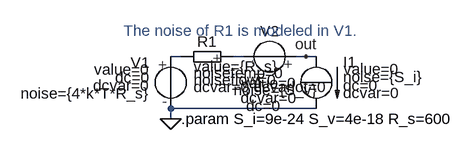
[diagram p0: schematic ExNoiseFigureAmp.asc]
ExNoiseFigureAmp.asc, the LTspice schematic file:
Version 4
SHEET 1 880 680
WIRE 128 0 112 0
WIRE 224 0 208 0
WIRE 320 0 304 0
WIRE 336 0 320 0
WIRE 336 80 112 80
WIRE 112 96 112 80
FLAG 112 96 0
FLAG 320 0 out
SYMBOL SLV 112 0 M0
WINDOW 40 32 57 Left 2
WINDOW 3 32 20 Left 2
WINDOW 123 32 32 Left 2
WINDOW 39 32 44 Left 2
SYMATTR InstName V1
SYMATTR SpiceLine2 noise={4*k*T*R_s}
SYMBOL SLR 208 0 R90
WINDOW 0 -8 40 VBottom 2
WINDOW 3 15 61 VLeft 2
WINDOW 123 25 61 VLeft 2
WINDOW 39 36 61 VLeft 2
WINDOW 40 47 61 VLeft 2
SYMATTR InstName R1
SYMATTR Value value={R_s}
SYMBOL SLI 336 0 R0
WINDOW 40 41 31 Left 2
WINDOW 3 42 19 Left 2
WINDOW 123 41 44 Left 2
WINDOW 39 41 56 Left 2
SYMATTR InstName I1
SYMATTR SpiceLine2 noise={S_i}
SYMBOL SLV 304 0 R90
WINDOW 0 -24 40 VBottom 2
WINDOW 3 25 41 VTop 2
WINDOW 123 60 49 VTop 2
WINDOW 39 48 41 VTop 2
WINDOW 40 36 30 VTop 2
SYMATTR InstName V2
SYMATTR SpiceLine2 noise={S_v}
TEXT 128 96 Left 2 !.param S_i=9e-24 S_v=4e-18 R_s=600
TEXT 40 -40 Left 2 ;The noise of R1 is modeled in V1.

The netlist it stands for:
* ExNoiseFigureAmp.asc
V1 N001 0 V value=0 dc=0 dcvar=0 noise={4*k*T*R_s}
R1 N002 N001 R value={R_s} noisetemp=0 noiseflow=0 dcvar=0 dcvarlot=0
I1 out 0 I value=0 dc=0 dcvar=0 noise={S_i}
V2 out N002 V value=0 dc=0 dcvar=0 noise={S_v}
.param S_i=9e-24 S_v=4e-18 R_s=600
* The noise of R1 is modeled in V1.
.backanno
.end